# Altium project display.PrjPcb
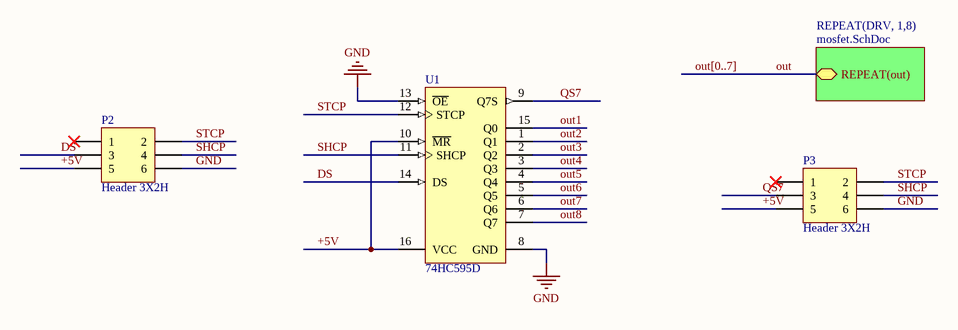
[diagram p0: display.SchDoc]
2 sheets, 35 parts. Net scope: hierarchical (ports join the sheet entries above them; power ports are global).
Board file: display_psb.PcbDoc
Sheets:
  display.SchDoc
    DRV1 = mosfet.SchDoc
    DRV2 = mosfet.SchDoc
    DRV3 = mosfet.SchDoc
    DRV4 = mosfet.SchDoc
    DRV5 = mosfet.SchDoc
    DRV6 = mosfet.SchDoc
    DRV7 = mosfet.SchDoc
    DRV8 = mosfet.SchDoc

## Sheet display.SchDoc
size A4

### Parts
P2  Header 3X2H  [HDR2X3H]
P3  Header 3X2H  [HDR2X3H]
U1  74HC595D  [NXP-SOT109-1_V]

### Sub-sheets
REPEAT(DRV, 1,8) = mosfet.SchDoc: REPEAT(out)

### Nets
GND: P2.6 P3.6 U1.8(GND) U1.13(~{OE})
+5V: P2.5 P3.5 U1.10(~{MR}) U1.16(VCC)
DS: P2.3 U1.14(DS)
out: sheet REPEAT(DRV, 1,8)/REPEAT(out)
out1: U1.15(Q0)
out2: U1.1(Q1)
out3: U1.2(Q2)
out4: U1.3(Q3)
out5: U1.4(Q4)
out6: U1.5(Q5)
out7: U1.6(Q6)
out8: U1.7(Q7)
QS7: P3.3 U1.9(Q7S)
SHCP: P2.4 P3.4 U1.11(SHCP)
STCP: P2.2 P3.2 U1.12(STCP)

Not connected (* = marked no-connect by the designer): P2 1*; P3 1*

### Buses and harness runs
bus out[0..7]

### Library data of the parts
P2 P3 = Header 3X2H: Header, 3-Pin, Dual row, Right Angle; LatestRevisionDate: 17-Jul-2002; LatestRevisionNote: Re-released for DXP Platform.; Publisher: Altium Limited
U1 = CMP-2000-04920-1: 8-Bit Serial-In, Serial or Parallel-Out Shift Register with Output Latches, 3-State, 2 to 6 V, -40 to 125 degC, 16-Pin SOP, RoHS, Tube; Manufacturer: NXP Semiconductors; Logic Case Style: SOIC; Shift Register Function: SerialtoParallel,SerialtoSerial; No. of Elements: 1Element; Supply Voltage Min: 2V; SVHC: NoSVHC(17-Dec-2014); Supply Voltage Max: 6V; IC Output Type: TriState; No. of Pins: 16Pins; Operating Temperature Min: -40degC; Operating Temperature Max: 125degC; MSL: MSL1-Unlimited; Datasheet URL: http://datasheet.octopart.com/74HC595D%2C112-Philips-datasheet-11979826.pdf; Package Reference: SOT109-1; Manufacturer URL: http://www.nxp.com/; Package URL: http://www.nxp.com/documents/outline_drawing/SOT109-1.pdf; Datasheet Version: Rev. 6, 12/2011; Packaging: Each; Package Description: 16-Pin Small Outline Integrated Circuit, Body 9.9 x 3.9 mm, Pitch 1.27 mm; Logic Type: ShiftRegister

## Sheet mosfet.SchDoc
size A4
Used 8 times, as channels DRV1, DRV2, DRV3, DRV4, DRV5, DRV6, DRV7, DRV8. Parts and nets are listed once, with the designators drawn on the sheet.
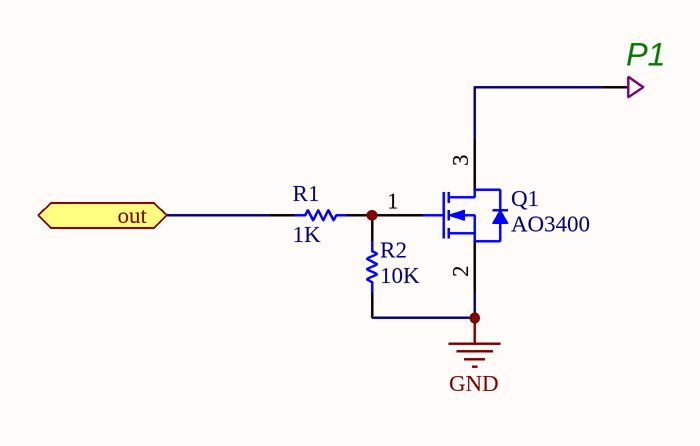
[diagram p1: mosfet.SchDoc]

### Parts
P1  pin  [pin]  (value not drawn)
Q1  AO3400  [AO-SOT23-3_V]
R1  1K  [RESC2013X70X40ML20T20]
R2  10K  [RESC2013X70X40ML20T20]

### Ports
out

### Nets
GND: Q1.2(S) R2.2
out: R1.2 ; port out
NetP1_0: P1.0 Q1.3(D)
NetQ1_1: Q1.1(G) R1.1 R2.1

### Channels
DRV1: designators end in _DRV1; ports out=out1
DRV2: designators end in _DRV2; ports out=out2
DRV3: designators end in _DRV3; ports out=out3
DRV4: designators end in _DRV4; ports out=out4
DRV5: designators end in _DRV5; ports out=out5
DRV6: designators end in _DRV6; ports out=out6
DRV7: designators end in _DRV7; ports out=out7
DRV8: designators end in _DRV8; ports out=out8

### Library data of the parts
Q1 = CMP-0278-00001-1: N-channel Enhancement Mode Field-Effect Transistor; 5.8A/30V; Manufacturer: Alpha and Omega; Channel Type: N; Drain-Source Voltage Limit: 30 V; Junction Temperature: -55 to 150 degC; Gate-Source Voltage Limit: +/-12 V; PackageDescription: 3-Pin SOT23, 3.016 x 2.8 mm Body, 0.95 mm Pitch; ComponentLink2Description: Datasheet; DatasheetVersion: Rev.8, 12/2011; ComponentLink3URL: http://www.aosmd.com/res/packaging_information/SOT-23.pdf; Storage Temperature: -55 to 150 degC; ComponentLink3Description: Package Specification; PackageReference: SOT23; ComponentLink1Description: Manufacturer URL; Mounting Technology: Surface Mount; ComponentLink1URL: http://www.aosmd.com/; PartNumber: AO3400; ComponentLink2URL: http://www.aosmd.com/res/data_sheets/AO3400.pdf
R1 R2 = CMP-2001-04440-2: RES SMD 150K OHM 1% 1/8W 0805; Manufacturer: Panasonic; Part Number: ERJ-6ENF1503V; Case-EIA: 0805; Datasheet: http://industrial.panasonic.com/cdbs/www-data/pdf/RDA0000/AOA0000C86.pdf

## Nets that join several sheets
GND: display (P2.6 P3.6 U1.8 U1.13), DRV1 (Q1_DRV1.2 R2_DRV1.2), DRV2 (Q1_DRV2.2 R2_DRV2.2), DRV3 (Q1_DRV3.2 R2_DRV3.2), DRV4 (Q1_DRV4.2 R2_DRV4.2), DRV5 (Q1_DRV5.2 R2_DRV5.2), DRV6 (Q1_DRV6.2 R2_DRV6.2), DRV7 (Q1_DRV7.2 R2_DRV7.2), DRV8 (Q1_DRV8.2 R2_DRV8.2)
out1: display (U1.15), DRV1 (R1_DRV1.2)
out2: display (U1.1), DRV2 (R1_DRV2.2)
out3: display (U1.2), DRV3 (R1_DRV3.2)
out4: display (U1.3), DRV4 (R1_DRV4.2)
out5: display (U1.4), DRV5 (R1_DRV5.2)
out6: display (U1.5), DRV6 (R1_DRV6.2)
out7: display (U1.6), DRV7 (R1_DRV7.2)
out8: display (U1.7), DRV8 (R1_DRV8.2)